# EAGLE design PSU15VRTR (EAGLE 7.6.0)
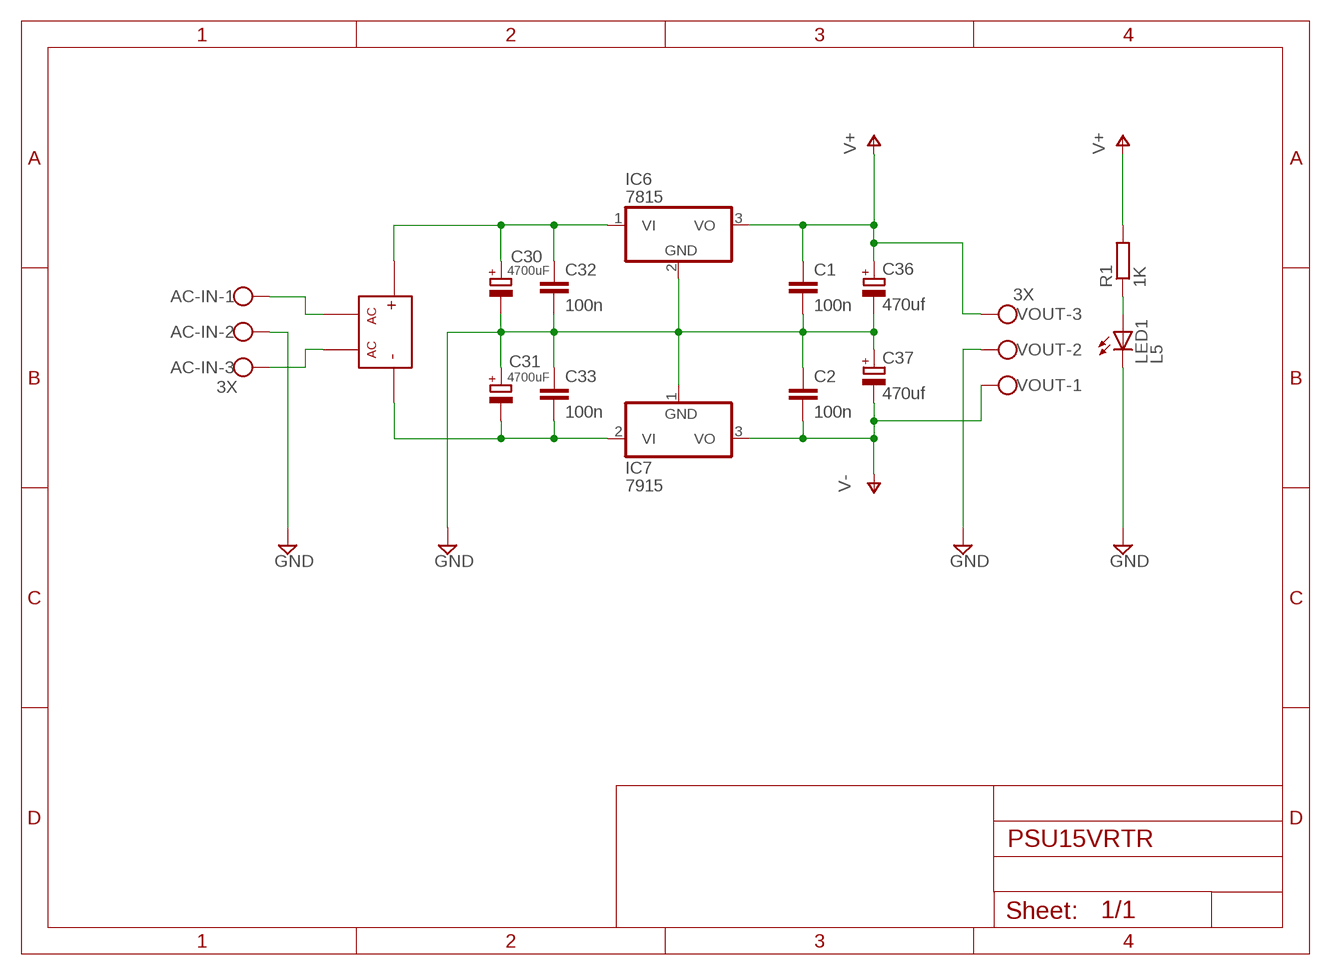
[diagram p0: schematic, sheet 1]

## Parts
AC-IN  3X  W237-103  [W237-103]
C1  100n  C-EU050-025X075  [C050-025X075]
C2  100n  C-EU050-025X075  [C050-025X075]
C30  4700uF  CPOL-EUE7.5-18  [E7,5-18]
C31  4700uF  CPOL-EUE7.5-18  [E7,5-18]
C32  100n  C-EU050-025X075  [C050-025X075]
C33  100n  C-EU050-025X075  [C050-025X075]
C36  470uf  CPOL-EUE3.5-8  [E3,5-8]
C37  470uf  CPOL-EUE3.5-8  [E3,5-8]
IC6  7815  7815T  [TO220H]
IC7  7915  7915T  [TO220H]
LED1  L5  LED5MM  [LED5MM]
R1  1K  R-EU_0204/7  [0204/7]
REC1  RECTIFIER  [RECTIFIER]
VOUT  3X  W237-103  [W237-103]

## Nets
AC1: AC-IN.1 REC1.AC1
AC2: AC-IN.3 REC1.AC0
GND: AC-IN.2 C1.2 C2.1 C30.- C31.+ C32.2 C33.1 C36.- C37.+ IC6.2(GND) IC7.1(GND) LED1.K(C) VOUT.2
N$3: LED1.A R1.1
N$46: C30.+ C32.1 IC6.1(VI) REC1.P
N$47: C31.- C33.2 IC7.2(VI) REC1.N
V+: C1.1 C36.+ IC6.3(VO) R1.2 VOUT.3
V-: C2.2 C37.- IC7.3(VO) VOUT.1

## Library data of the parts
AC-IN VOUT = con-wago-500:W237-103: WAGO SCREW CLAMP; MPN: 237-103; OC_FARNELL: unknown; OC_NEWARK: 18M7116
C1 C2 C32 C33 = resistor:C-EU: CAPACITOR, European symbol
C30 C31 C36 C37 = resistor:CPOL-EU: POLARIZED CAPACITOR, European symbol
IC6 = linear:78*: Positive VOLTAGE REGULATOR Source: http://cache.national.com/ds/LM/LM78L05.pdf http://www.fairchildsemi.com/ds/LM/LM7805.pdf
IC7 = linear:79*: Negative VOLTAGE REGULATOR
LED1 = adafruit:LED: LED OSRAM: - CHIPLED LG R971, LG N971, LY N971, LG Q971, LY Q971, LO R971, LY R971 LH N974, LH R974 LS Q976, LO Q976, LY Q976 LO Q996 - Hyper CHIPLED LW Q18S LB Q993, LB Q99A, LB R99A - SideLED LS A670, LO A670, LY A670, LG A670, LP A670 LB A673, LV A673, LT A673, LW A673 LH A674 LY A675 LS A676, LA A676, LO A676, LY A676, LW A676 LS A679, LY A679, LG A679 - Hyper Micro SIDELED® LS Y876, LA Y876, LO Y876, LY Y876 LT Y87S - SmartLED LW L88C, LW L88S LB L89C, LB L89S, LG L890 LS L89K, LO L89K, LY L89K LS L896, LA L896, LO L896, LY L896 - TOPLED LS T670, LO T670, LY T670, LG T670, LP T670 LSG T670, LSP T670, LSY T670, LOP T670, LYG T670 LG T671, LOG T671, LSG T671 LB T673, LV T673, LT T673, LW T673 LH T674 LS T676, LA T676, LO T676, LY T676, LB T676, LH T676, LSB T676, LW T676 LB T67C, LV T67C, LT T67C, LS T67K, LO T67K, LY T67K, LW E67C LS E67B, LA E67B, LO E67B, LY E67B, LB E67C, LV E67C, LT E67C LW T67C LS T679, LY T679, LG T679 LS T770, LO T770, LY T770, LG T770, LP T770 LB T773, LV T773, LT T773, LW T773 LH T774 LS E675, LA E675, LY E675, LS T675 LS T776, LA T776, LO T776, LY T776, LB T776 LHGB T686 LT T68C, LB T68C - Hyper Mini TOPLED® LB M676 - Mini TOPLED Santana® LG M470 LS M47K, LO M47K, LY M47K Source: http://www.osram.convergy.de/
R1 = resistor:R-EU_: RESISTOR, European symbol
REC1 = ioshub:RECTIFIER

## Board
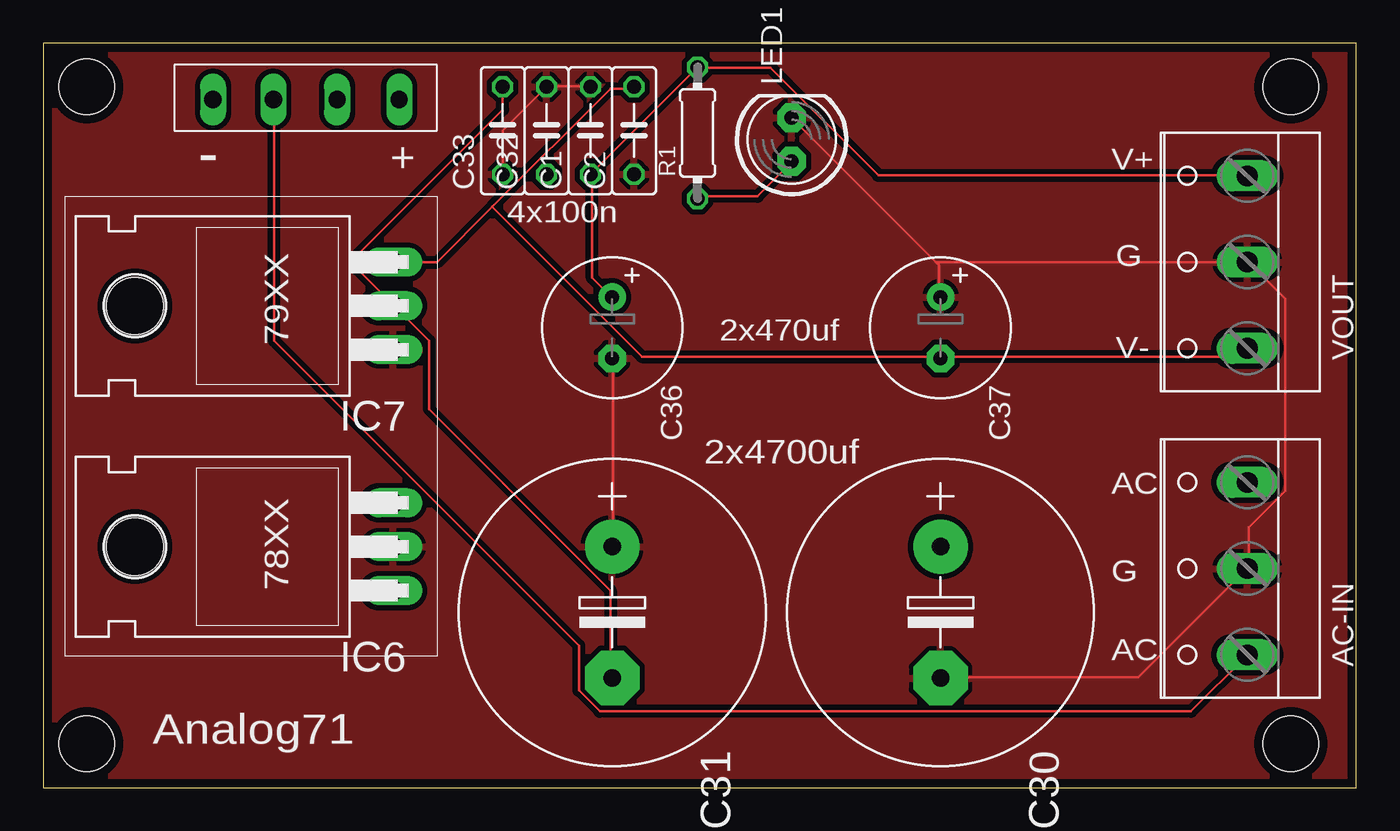
[diagram p1: board, top side]
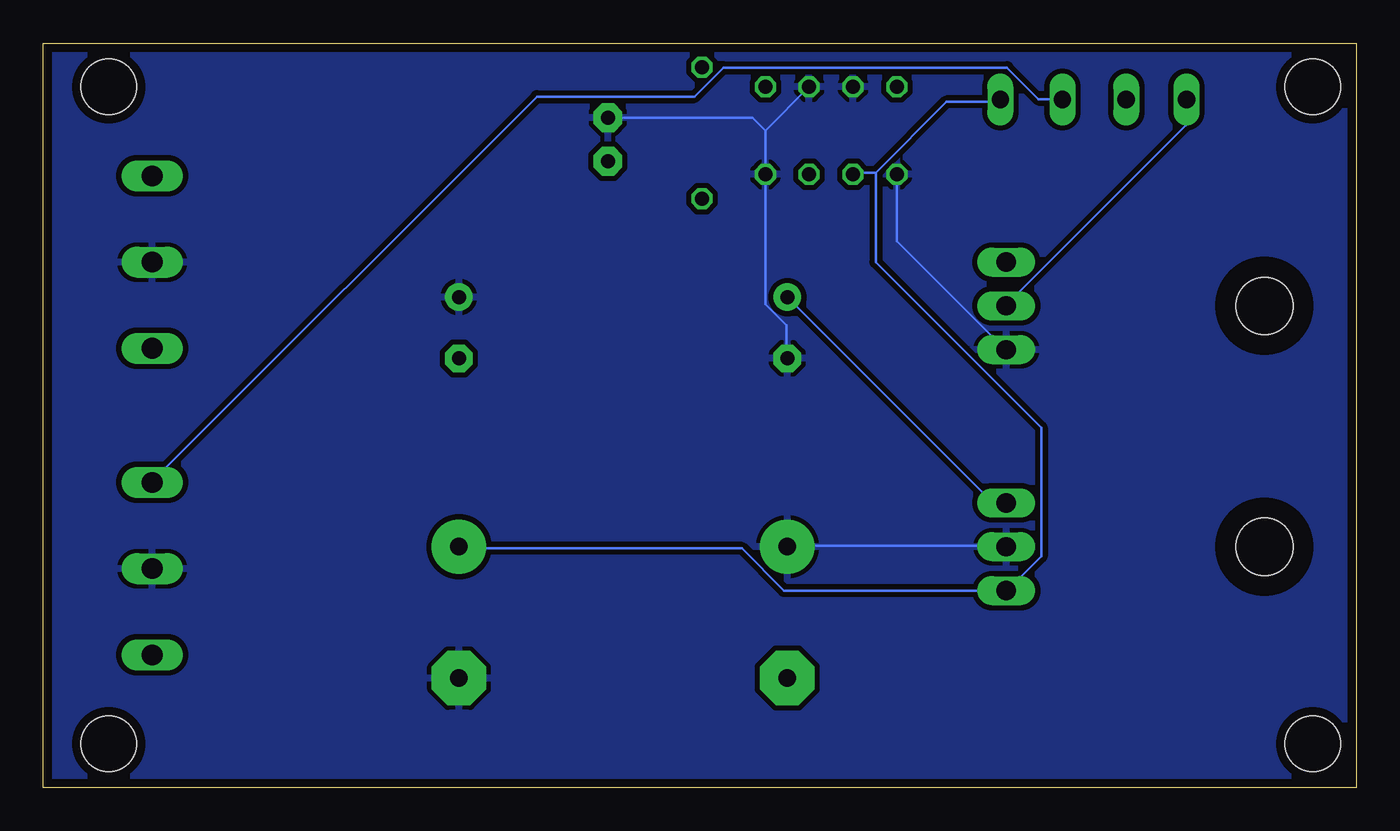
[diagram p2: board, bottom side, seen from below]

Size 76.2 x 43.18 mm. Coordinates in mm from the lower left corner, seen from the top.
Outline: 0,0 76.2,0 76.2,43.18 0,43.18 0,0
Copper layers (1*16): Top 0.035mm / dielectric 1.6mm / Bottom 0.035mm
Design rules "Elecrow_2-layer_PCB_eagle_rule": minimum track width 6mil, minimum drill 12mil, track to track 6mil, track to pad 8mil, pad to pad 12mil, via to via 12mil, smd to smd 0mil, copper to edge 20mil, drill to drill 10mil, minimum pad ring 6mil, minimum via ring 6mil, stop-mask expansion 0mil, vias tented up to drill 100mil, thermal gap 10mil
Holes 3.2 mm at 2.54,2.54 72.39,2.54 72.39,40.64 2.54,40.64

### Footprints (pad centres in the part's own frame; a part is rotated, then mirrored left to right if it is on the bottom)
W237-103 = drill 1.194 long: 1 -5,-1.29; 2 0,-1.29; 3 5,-1.29
C050-025X075 = drill 0.813 octagon: 1 -2.54,0; 2 2.54,0
E7,5-18 = drill 1.016 pad 3.15: + -3.81,0 | drill 1.016 pad 3.15 octagon: - 3.81,0
E3,5-8 = drill 0.813 pad 1.6: + -1.778,0 | drill 0.813 pad 1.6 octagon: - 1.778,0
TO220H = drill 1.118 long: 1 -2.54,-10.16; 2 0,-10.16; 3 2.54,-10.16 | hole 3.302: 0,4.826
LED5MM = drill 0.813 pad 1.676 octagon: A -1.27,0; K 1.27,0
0204/7 = drill 0.813 octagon: 1 -3.81,0; 2 3.81,0
RECTIFIER = drill 1 long: AC0 -3.09,0.73; AC1 0.61,0.73; N 4.11,0.73; P -6.69,0.73

### Placement (x,y rotation side)
AC-IN  68.58,12.7 90 top
C1  31.75,38.1 90 top
C2  34.29,38.1 90 top
C30  52.07,10.16 270 top
C31  33.02,10.16 270 top
C32  29.21,38.1 90 top
C33  26.67,38.1 90 top
C36  33.02,26.67 270 top
C37  52.07,26.67 270 top
IC6  10.16,13.97 90 top
IC7  10.16,27.94 90 top
LED1  43.43,37.59 90 top
R1  37.97,37.97 90 top
REC1  13.97,40.64 180 top
VOUT  68.58,30.48 90 top

### Tracks (layer width: path | path; a pad name or v marks a point on that pad's centre or on a via)
AC1
  Top 0.152: REC1.AC1 13.41,39.78 13.41,25.91 31.09,8.23 31.09,5.64 32.31,4.42 66.6,4.42 69.8,7.62 AC-IN.1
AC2
  Bottom 0.152: REC1.AC0 17.07,39.93 18.44,39.93 20.27,41.76 36.73,41.76 38.41,40.08 47.55,40.08 69.8,17.83 AC-IN.3
GND
  Top 0.152: C30.- 52.12,6.4 63.55,6.4 69.8,12.65 AC-IN.2 69.95,12.8 69.95,15.09 72.08,17.22 72.08,28.35 69.95,30.48 VOUT.2 51.82,30.48 | C36.- 33.07,24.84 33.07,14.02 C31.+ | LED1.K 51.82,30.48 | 51.82,30.48 51.97,30.33 51.97,28.5 C37.+ | C33.1 26.67,38.1 C32.2 29.26,40.69 31.7,40.69 C1.2
  Bottom 0.152: IC6.2 20.42,14.02 32.92,14.02 C31.+ | 34.29,38.1 C2.1 34.29,28.04 33.07,26.82 33.07,24.99 C36.- | C1.2 34.29,38.1 | C33.1 26.67,31.7 20.42,25.45 IC7.1 | LED1.K 35.05,38.86 34.29,38.1
  pour Bottom (isolate 0.305): 0,0 76.2,0 76.2,43.18 0,43.18
  pour Top (isolate 0.305): 0,0 76.2,0 76.2,43.18 0,43.18
N$3
  Top 0.152: R1.1 38.1,34.29 41.45,34.29 43.43,36.27 LED1.A
N$46
  Bottom 0.152: 27.89,35.66 29.11,35.66 C32.1 | 27.89,35.66 23.77,39.78 20.73,39.78 REC1.P | 27.89,35.66 27.89,30.48 18.29,20.88 18.29,13.41 20.27,11.43 IC6.1 33.22,11.43 35.66,13.87 51.97,13.87 C30.+
N$47
  Top 0.152: C33.2 26.67,39.32 18.29,30.94 18.29,30.02 20.27,28.04 IC7.2 20.42,27.89 22.4,25.91 22.4,21.95 32.92,11.43 32.92,6.4 C31.-
  Bottom 0.152: REC1.N 9.91,39.78 9.91,38.41 20.27,28.04 IC7.2
V+
  Top 0.152: C36.+ 32.92,28.5 31.85,29.57 31.85,35.51 C1.1 R1.2 38.1,41.76 42.22,41.76 48.46,35.51 69.8,35.51 VOUT.3
  Bottom 0.152: C36.+ 21.18,16.61 20.42,16.61 IC6.3
V-
  Top 0.152: VOUT.1 69.8,25.45 69.34,24.99 52.12,24.99 C37.- 51.97,24.99 34.75,24.99 26.06,33.68 | 26.06,33.68 22.86,30.48 IC7.3 | 26.06,33.68 32.92,40.54 34.29,40.54 C2.2

### Text on the board
tPlace: V+ | 4x100n | G | 79XX | 2x470uf | V- | 2x4700uf | AC | G | 78XX | AC | Analog71